# EasyEDA schematic Schematic.json
TITLE: Επιβλέπων καθηγητής κ.Καραπιδάκης; REV: 1.0; Date: 2021-12-04; Sheet: 1/1; Drawn By: Aristos Karmiotis; Company: Πτυχιακή Εργασία Καρμιώτη
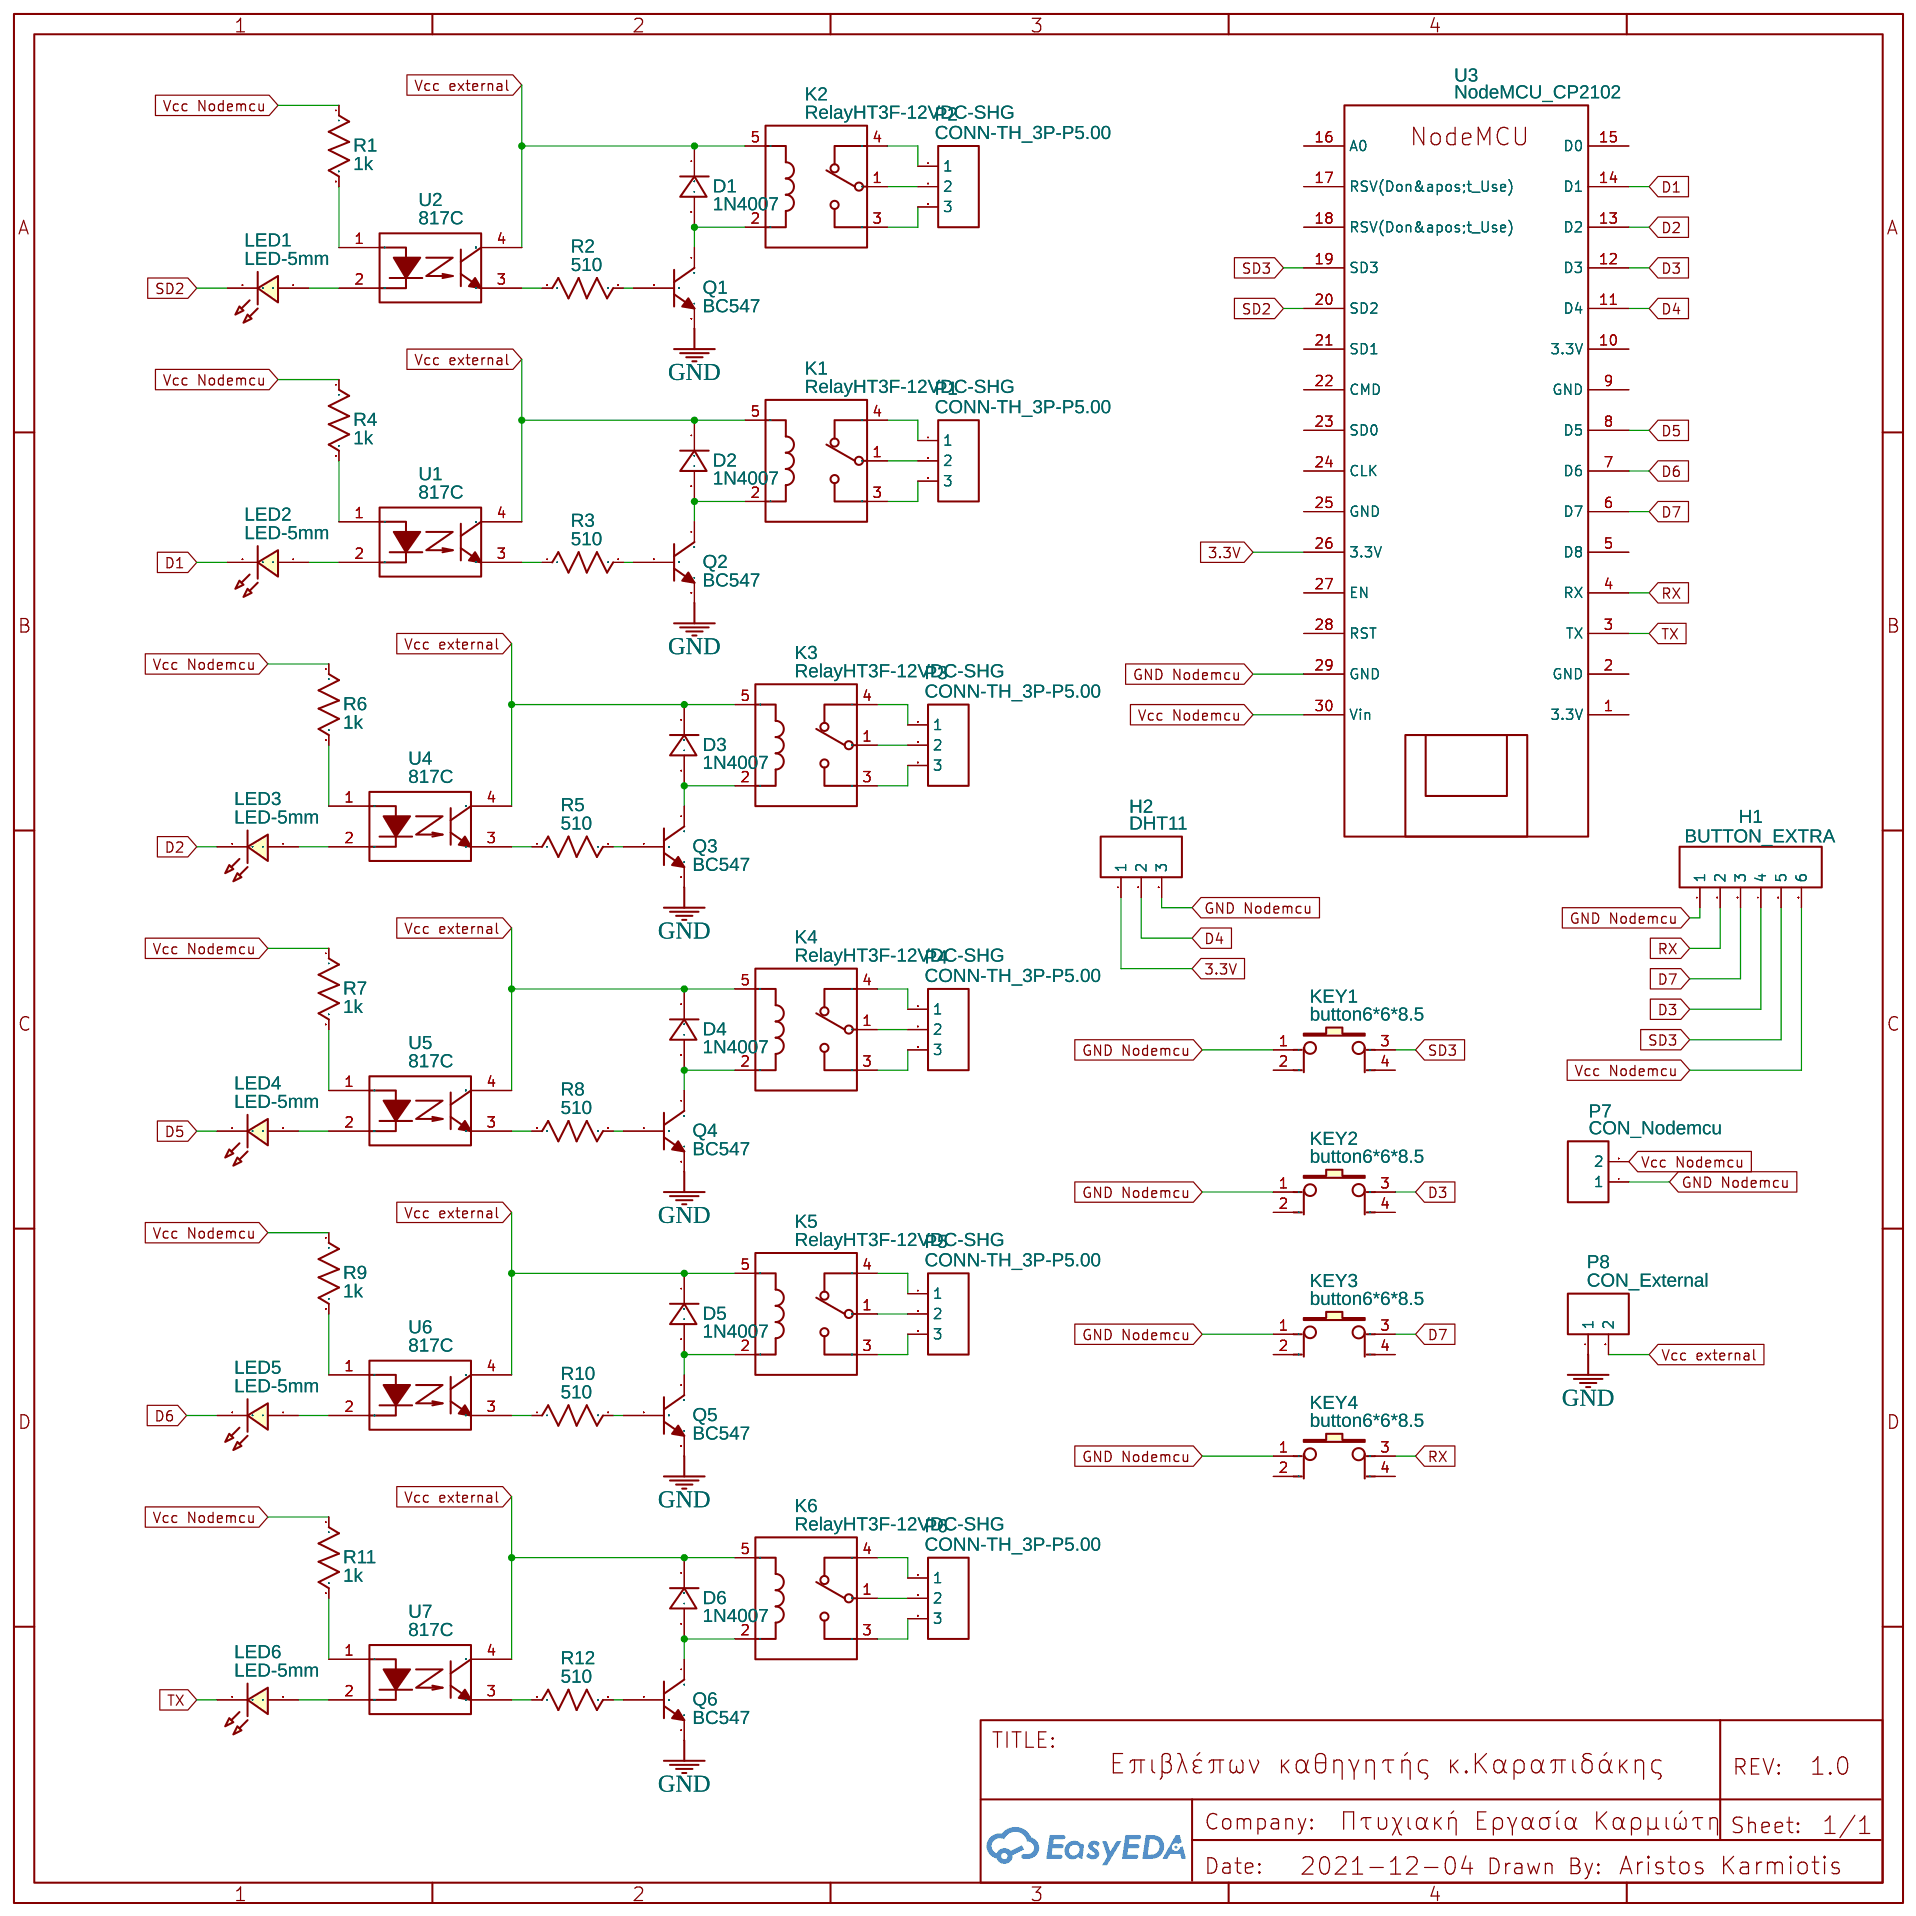
[diagram p0: schematic sheet]

## Parts
D1  1N4007  [DO-204AL_BD2.4-L4.7-P8.70-D1.1-RD]
D2  1N4007  [DO-204AL_BD2.4-L4.7-P8.70-D1.1-RD]
D3  1N4007  [DO-204AL_BD2.4-L4.7-P8.70-D1.1-RD]
D4  1N4007  [DO-204AL_BD2.4-L4.7-P8.70-D1.1-RD]
D5  1N4007  [DO-204AL_BD2.4-L4.7-P8.70-D1.1-RD]
D6  1N4007  [DO-204AL_BD2.4-L4.7-P8.70-D1.1-RD]
H1  BUTTON_EXTRA  [HDR-F-2.54_1X6]
H2  DHT11  [HDR-F-2.54_1X3]
K1  RelayHT3F-12VDC-SHG  [RELAY-TH_HT3F-DCXX-X/X]
K2  RelayHT3F-12VDC-SHG  [RELAY-TH_HT3F-DCXX-X/X]
K3  RelayHT3F-12VDC-SHG  [RELAY-TH_HT3F-DCXX-X/X]
K4  RelayHT3F-12VDC-SHG  [RELAY-TH_HT3F-DCXX-X/X]
K5  RelayHT3F-12VDC-SHG  [RELAY-TH_HT3F-DCXX-X/X]
K6  RelayHT3F-12VDC-SHG  [RELAY-TH_HT3F-DCXX-X/X]
KEY1  button6*6*8.5  [KEY-TH_4P-L6.0-W6.0-P4.50]
KEY2  button6*6*8.5  [KEY-TH_4P-L6.0-W6.0-P4.50]
KEY3  button6*6*8.5  [KEY-TH_4P-L6.0-W6.0-P4.50]
KEY4  button6*6*8.5  [KEY-TH_4P-L6.0-W6.0-P4.50]
LED1  LED-5mm  [LED-TH_BD5.0_RED]
LED2  LED-5mm  [LED-TH_BD5.0_RED]
LED3  LED-5mm  [LED-TH_BD5.0_RED]
LED4  LED-5mm  [LED-TH_BD5.0_RED]
LED5  LED-5mm  [LED-TH_BD5.0_RED]
LED6  LED-5mm  [LED-TH_BD5.0_RED]
P1  CONN-TH_3P-P5.00  [CONN-TH_3P-P5.00]
P2  CONN-TH_3P-P5.00  [CONN-TH_3P-P5.00]
P3  CONN-TH_3P-P5.00  [CONN-TH_3P-P5.00]
P4  CONN-TH_3P-P5.00  [CONN-TH_3P-P5.00]
P5  CONN-TH_3P-P5.00  [CONN-TH_3P-P5.00]
P6  CONN-TH_3P-P5.00  [CONN-TH_3P-P5.00]
P7  CON_Nodemcu  [CONN-TH_2P-P5.00]
P8  CON_External  [CONN-TH_2P-P5.00]
Q1  BC547  [TO-92-3_L4.9-W3.7-P2.54-L]
Q2  BC547  [TO-92-3_L4.9-W3.7-P2.54-L]
Q3  BC547  [TO-92-3_L4.9-W3.7-P2.54-L]
Q4  BC547  [TO-92-3_L4.9-W3.7-P2.54-L]
Q5  BC547  [TO-92-3_L4.9-W3.7-P2.54-L]
Q6  BC547  [TO-92-3_L4.9-W3.7-P2.54-L]
R1  1k  [R_AXIAL-0.4]
R2  510  [R_AXIAL-0.4]
R3  510  [R_AXIAL-0.4]
R4  1k  [R_AXIAL-0.4]
R5  510  [R_AXIAL-0.4]
R6  1k  [R_AXIAL-0.4]
R7  1k  [R_AXIAL-0.4]
R8  510  [R_AXIAL-0.4]
R9  1k  [R_AXIAL-0.4]
R10  510  [R_AXIAL-0.4]
R11  1k  [R_AXIAL-0.4]
R12  510  [R_AXIAL-0.4]
U1  817C  [DIP-4_L6.4-W4.6-P2.54-LS7.6-BL]
U2  817C  [DIP-4_L6.4-W4.6-P2.54-LS7.6-BL]
U3  NodeMCU_CP2102  [NODEMCU_CP2102]
U4  817C  [DIP-4_L6.4-W4.6-P2.54-LS7.6-BL]
U5  817C  [DIP-4_L6.4-W4.6-P2.54-LS7.6-BL]
U6  817C  [DIP-4_L6.4-W4.6-P2.54-LS7.6-BL]
U7  817C  [DIP-4_L6.4-W4.6-P2.54-LS7.6-BL]

## Library data of the parts
D1-D6 = 1N4007G-K: Supplier: LCSC; Supplier Part: C410859; Manufacturer: Taiwan Semicon; Contributor: LCSC; JLCPCB Part Class: Extended Part
H1 = HDR-F-2.54_1x6: Supplier Part: C40877; Supplier: LCSC; Contributor: LCEDA_Lib
H2 = HDR-F-2.54_1x3: Supplier Part: C146690; Supplier: LCSC; Contributor: LCEDA_Lib
K1-K6 = RelayHT3F-12VDC-SHG: Supplier: LCSC; Manufacturer: HTV; image: //image.lceda.cn/szlcsc/C22022.jpg; Supplier Part: C22022; Contributor: fmarzocca
KEY1-KEY4 = button6*6*8.5: Supplier Part: C59980; Supplier: LCSC; Manufacturer: ReliaPro
LED1-LED6 = LED-TH-5mm_R: Manufacturer: EVERLIGHT(台湾亿光); Manufacturer Part: 333-2SURD/S530-A3; Supplier Part: C87271; Supplier: LCSC; Contributor: LCEDA_Lib
P1-P6 = CONN-TH_3P-P5.00: Supplier: LCSC; Contributor: LCEDA_Lib
P7 P8 = CONN-TH_2P-P5.00: Supplier: LCSC; Contributor: LCEDA_Lib
Q1-Q6 = BC547BTF: Supplier: LCSC; Supplier Part: C900798; Manufacturer: ON(安森美); Contributor: LCSC
R1-R12 = R_AXIAL-0.4_US: Contributor: LCEDA_Lib
U1 U2 U4-U7 = FOD817C300: Supplier: LCSC; Supplier Part: C124472; Manufacturer: ON Semicon; Contributor: LCSC; JLCPCB Part Class: Extended Part
U3 = NodeMCU_CP2102: Contributor: Vakhtang

## Nets
3.3V: H2.1 U3.26(3.3V)
GND: P8.1 Q1.3(E) Q2.3(E) Q3.3(E) Q4.3(E) Q5.3(E) Q6.3(E)
GND Nodemcu: H1.1 H2.3 KEY1.1 KEY2.1 KEY3.1 KEY4.1 P7.1 U3.29(GND)
Vcc external: D1.1(C) D2.1(C) D3.1(C) D4.1(C) D5.1(C) D6.1(C) K1.5 K2.5 K3.5 K4.5 K5.5 K6.5 P8.2 U1.4(COL) U2.4(COL) U4.4(COL) U5.4(COL) U6.4(COL) U7.4(COL)
Vcc Nodemcu: H1.6 P7.2 R1.1 R4.1 R6.1 R7.1 R9.1 R11.1 U3.30(Vin)
D1: LED2.2 U3.14(D1)
D2: LED3.2 U3.13(D2)
D3: H1.4 KEY2.3 U3.12(D3)
D4: H2.2 U3.11(D4)
D5: LED4.2 U3.8(D5)
D6: LED5.2 U3.7(D6)
D7: H1.3 KEY3.3 U3.6(D7)
RX: H1.2 KEY4.3 U3.4(RX)
SD2: LED1.2 U3.20(SD2)
SD3: H1.5 KEY1.3 U3.19(SD3)
TX: LED6.2 U3.3(TX)
Net-(D1-2): D1.2(A) K2.2 Q1.1(C)
Net-(D2-2): D2.2(A) K1.2 Q2.1(C)
Net-(D3-2): D3.2(A) K3.2 Q3.1(C)
Net-(D4-2): D4.2(A) K4.2 Q4.1(C)
Net-(D5-2): D5.2(A) K5.2 Q5.1(C)
Net-(D6-2): D6.2(A) K6.2 Q6.1(C)
Net-(K1-1): K1.1 P1.2
Net-(K1-3): K1.3 P1.3
Net-(K1-4): K1.4 P1.1
Net-(K2-1): K2.1 P2.2
Net-(K2-3): K2.3 P2.3
Net-(K2-4): K2.4 P2.1
Net-(K3-1): K3.1 P3.2
Net-(K3-3): K3.3 P3.3
Net-(K3-4): K3.4 P3.1
Net-(K4-1): K4.1 P4.2
Net-(K4-3): K4.3 P4.3
Net-(K4-4): K4.4 P4.1
Net-(K5-1): K5.1 P5.2
Net-(K5-3): K5.3 P5.3
Net-(K5-4): K5.4 P5.1
Net-(K6-1): K6.1 P6.2
Net-(K6-3): K6.3 P6.3
Net-(K6-4): K6.4 P6.1
Net-(LED1-1): LED1.1 U2.2(CAT)
Net-(LED2-1): LED2.1 U1.2(CAT)
Net-(LED3-1): LED3.1 U4.2(CAT)
Net-(LED4-1): LED4.1 U5.2(CAT)
Net-(LED5-1): LED5.1 U6.2(CAT)
Net-(LED6-1): LED6.1 U7.2(CAT)
Net-(Q1-2): Q1.2(B) R2.2
Net-(Q2-2): Q2.2(B) R3.2
Net-(Q3-2): Q3.2(B) R5.2
Net-(Q4-2): Q4.2(B) R8.2
Net-(Q5-2): Q5.2(B) R10.2
Net-(Q6-2): Q6.2(B) R12.2
Net-(R1-2): R1.2 U2.1(AN)
Net-(R2-1): R2.1 U2.3(EM)
Net-(R3-1): R3.1 U1.3(EM)
Net-(R4-2): R4.2 U1.1(AN)
Net-(R5-1): R5.1 U4.3(EM)
Net-(R6-2): R6.2 U4.1(AN)
Net-(R7-2): R7.2 U5.1(AN)
Net-(R8-1): R8.1 U5.3(EM)
Net-(R9-2): R9.2 U6.1(AN)
Net-(R10-1): R10.1 U6.3(EM)
Net-(R11-2): R11.2 U7.1(AN)
Net-(R12-1): R12.1 U7.3(EM)

Not connected (* = marked no-connect by the designer): KEY1 2 4; KEY2 2 4; KEY3 2 4; KEY4 2 4; U3 1(3.3V) 2(GND) 5(D8) 9(GND) 10(3.3V) 15(D0) 16(A0) 17(RSV(Don't Use)) 18(RSV(Don't Use)) 21(SD1) 22(CMD) 23(SD0) 24(CLK) 25(GND) 27(EN) 28(RST)
